# EAGLE design 3.3V_StepDown (EAGLE 9.4.2)
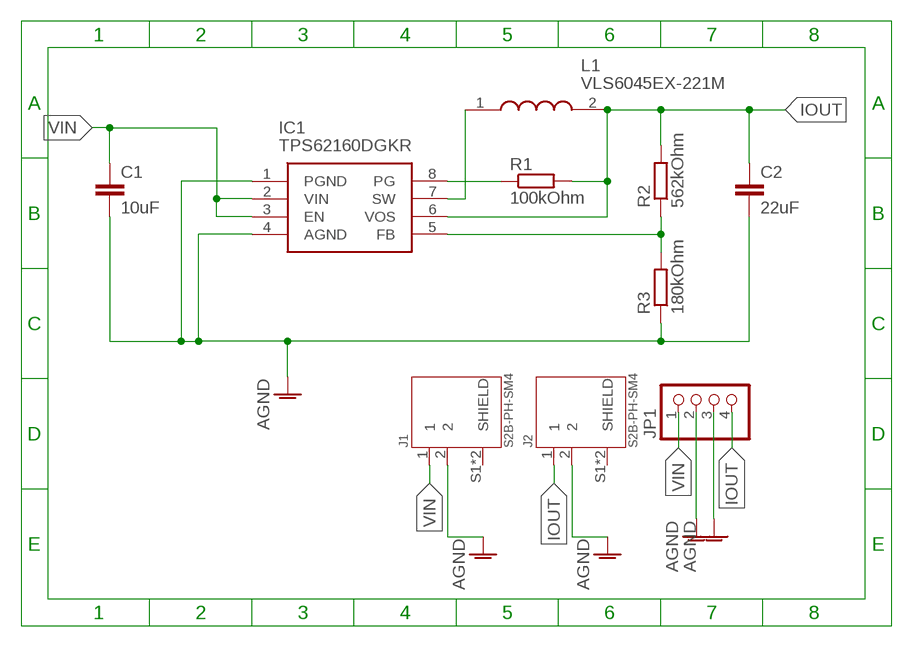
[diagram p0: schematic, sheet 1]

## Parts
C1  10uF  CNC5L1X7R1C106K160AEC1206  [C1206]
C2  22uF  GRM219R61C226ME15KC0805K  [C0805K]
IC1  TPS62160DGKR  [SOP65P490X110-8N]
J1  S2B-PH-SM4  [JST_S2B-PH-SM4-TB(LF)(SN)]
J2  S2B-PH-SM4  [JST_S2B-PH-SM4-TB(LF)(SN)]
JP1  PINHD-1X4  [1X04]
L1  VLS6045EX-221M  [INDPM6060X450N]
R1  100kOhm  RCS1206100KJNEAR1206  [R1206]
R2  562kOhm  ERJ-PB6B5623VR0805  [R0805]
R3  180kOhm  RN73R1ETTP1803D25R0402  [R0402]

## Nets
AGND: C1.2 C2.2 IC1.1(PGND) IC1.4(AGND) J1.2 J2.2 JP1.2 JP1.3 R3.1
FB2: IC1.5(FB) R2.1 R3.2
IOUT: C2.1 IC1.6(VOS) J2.1 JP1.4 L1.2 R1.2 R2.2
PG2: IC1.8(PG) R1.1
SW2: IC1.7(SW) L1.1
VIN: C1.1 IC1.2(VIN) IC1.3(EN) J1.1 JP1.1
Unconnected: J1.S1(SHIELD) J1.S2(SHIELD) J2.S1(SHIELD) J2.S2(SHIELD)

## Library data of the parts
C1 = MouserUseful:CNC5L1X7R1C106K160AE: CAPACITOR, European symbol; MAX: 16V; SPICEPREFIX: C
C2 = MouserUseful:GRM219R61C226ME15K: CAPACITOR, European symbol; MAXV: 16V; SPICEPREFIX: C
IC1 = MouserUseful:TPS62160DGKR: Switching Voltage Regulators 3V-17V 1A Step-Down Converter Source: Datasheet <http://www.ti.com/lit/ds/symlink/tps62160.pdf>; DESCRIPTION: Switching Voltage Regulators 3V-17V 1A Step-Down Converter; HEIGHT: 1.1mm; MANUFACTURER_NAME: Texas Instruments; MANUFACTURER_PART_NUMBER: TPS62160DGKR; MOUSER_PART_NUMBER: 595-TPS62160DGKR; MOUSER_PRICE-STOCK: https://www.mouser.com/Search/Refine.aspx?Keyword=595-TPS62160DGKR
J1 J2 = CommonParts:S2B-PH-SM4: PH Series 2 Position 2 mm Pitch Surface Mount Side Entry Shrouded Header; DESCRIPTION: PH Series 2 Position 2 mm Pitch Surface Mount Side Entry Shrouded Header; DIGI-KEY_PART_NUMBER: 455-1749-1-ND; DIGI-KEY_PURCHASE_URL: https://www.digikey.com/product-detail/en/jst-sales-america-inc/S2B-PH-SM4-TB_LF__SN_/455-1749-1-ND/926846?utm_source=snapeda&utm_medium=aggregator&utm_campaign=symbol; MF: JST Sales; MP: S2B-PH-SM4-TB_LF__SN_; PACKAGE: None
JP1 = pinhead:PINHD-1X4: PIN HEADER
L1 = MouserUseful:VLS6045EX-221M: Wirewound Inductor 220uH 500mA 1.15 mOhm TDK VLS-EX Series Shielded Wire-wound SMD Inductor with a Ferrite Core, 220 uH Wire-Wound 500mA Idc Source: Datasheet <https://product.tdk.com/info/en/catalog/datasheets/inductor_commercial_power_vls6045ex_en.pdf>; DESCRIPTION: Wirewound Inductor 220uH 500mA 1.15 mOhm TDK VLS-EX Series Shielded Wire-wound SMD Inductor with a Ferrite Core, 220 uH Wire-Wound 500mA Idc; HEIGHT: 4.5mm; MANUFACTURER_NAME: TDK; MANUFACTURER_PART_NUMBER: VLS6045EX-221M; MOUSER_PART_NUMBER: 810-VLS6045EX-221M; MOUSER_PRICE-STOCK: https://www.mouser.com/Search/Refine.aspx?Keyword=810-VLS6045EX-221M; RS_PART_NUMBER: 1247062; RS_PRICE-STOCK: http://uk.rs-online.com/web/p/products/1247062
R1 = MouserUseful:RCS1206100KJNEA: RESISTOR, European symbol; SPICEPREFIX: R; WATT: 0.5
R2 = MouserUseful:ERJ-PB6B5623V: RESISTOR, European symbol
R3 = MouserUseful:RN73R1ETTP1803D25: RESISTOR, European symbol; WATT: 0.5

## Board
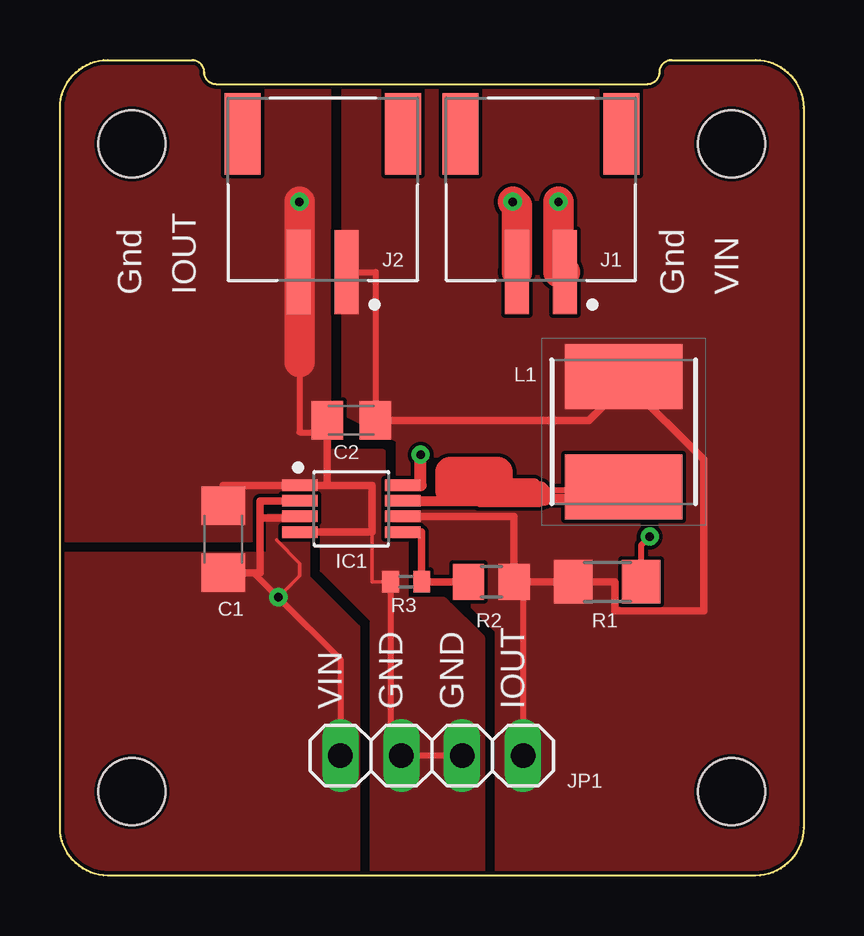
[diagram p1: board, top side]
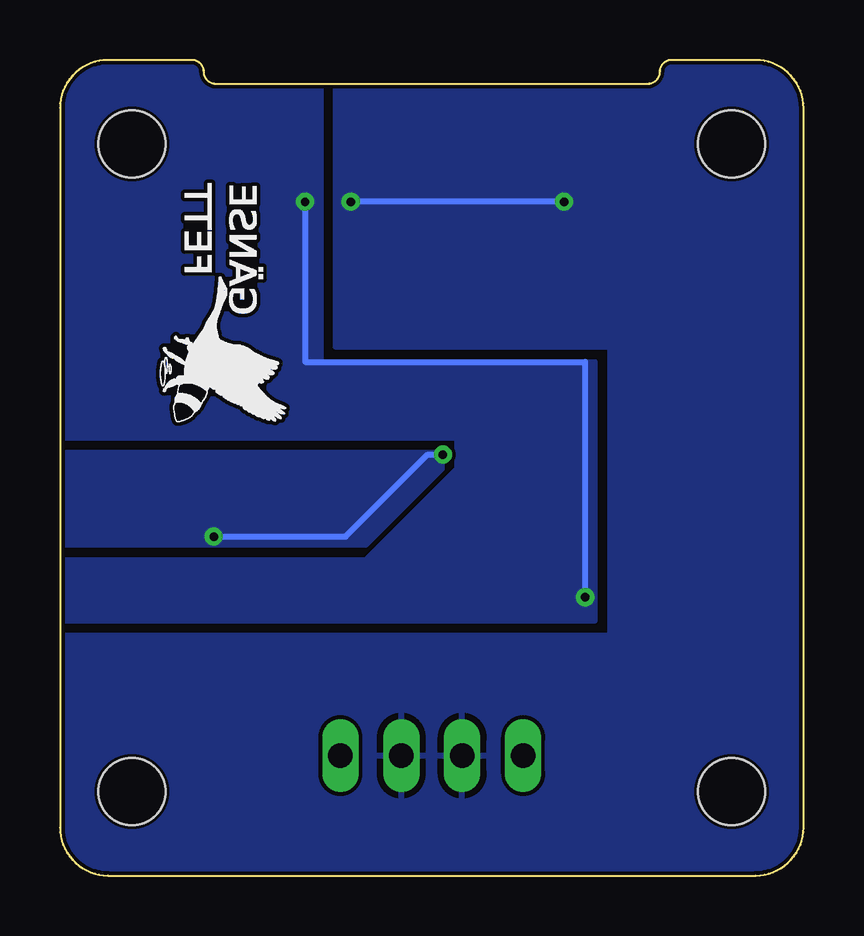
[diagram p2: board, bottom side, seen from below]

Size 31 x 34 mm. Coordinates in mm from the lower left corner, seen from the top.
Outline: 25.5,34 29,34 arc-90 31,32 31,2 arc-90 29,0 2,0 arc-90 0,2 0,32 arc-90 2,34 5.5,34 arc-90 6,33.5 arc90 6.5,33 24.5,33 arc90 25,33.5 arc-90 25.5,34
Copper layers (1*16): Top 0.035mm / dielectric 1.5mm / Bottom 0.035mm
Design rules "default *": minimum track width 6mil, minimum drill 0.35mm, track to track 6mil, track to pad 6mil, pad to pad 6mil, via to via 6mil, smd to smd 6mil, copper to edge 6mil, drill to drill 6mil, minimum pad ring 10mil, minimum via ring 8mil, stop-mask expansion 4mil, vias tented up to drill 0mil, thermal gap 10mil
Holes 2.8 mm at 3,3.5 28,3.5 3,30.5 28,30.5
bKeepout: area 26,18.9 to 26.1,18.9; area 22,18.9 to 22,18.9; area 25.9,18.9 to 26.2,18.9; area 22,18.9 to 22.1,19; area 25.9,18.9 to 26.1,19; area 26.1,18.9 to 26.2,19; area 22,19 to 22.1,19; area 25.8,19 to 26,19; area 26.1,19 to 26.2,19; area 22,19 to 22.1,19; area 22.2,19 to 22.3,19; area 25.8,19 to 25.9,19; 2280 more areas

### Footprints (pad centres in the part's own frame; a part is rotated, then mirrored left to right if it is on the bottom)
C1206 = smd 1.6 x 1.8: 1 -1.4,0; 2 1.4,0
C0805K = smd 1.3 x 1.6: 1 -1,0; 2 1,0
SOP65P490X110-8N = smd 1.471 x 0.481: 1 -2.15,0.975; 2 -2.15,0.325; 3 -2.15,-0.325; 4 -2.15,-0.975; 5 2.15,-0.975; 6 2.15,-0.325; 7 2.15,0.325; 8 2.15,0.975
JST_S2B-PH-SM4-TB(LF)(SN) = smd 1 x 3.5: 1 -1,0; 2 1,0 | smd 1.5 x 3.4: S1 -3.35,-5.75; S2 3.35,-5.75
1X04 = drill 1.016 long: 1 -3.81,0; 2 -1.27,0; 3 1.27,0; 4 3.81,0
INDPM6060X450N = smd 2.7 x 4.9: 1 -2.3,0; 2 2.3,0
R1206 = smd 1.6 x 1.803: 1 -1.422,0; 2 1.422,0
R0805 = smd 1.3 x 1.5: 1 -0.95,0; 2 0.95,0
R0402 = smd 0.7 x 0.9: 1 -0.65,0; 2 0.65,0

### Placement (x,y rotation side)
C1  6.81,14.03 90 top
C2  12.14,18.98 180 top
IC1  12.14,15.29 0 top
J1  20.05,25.16 180 top
J2  10.96,25.16 180 top
JP1  15.5,5 0 top
L1  23.5,18.5 90 top
R1  22.81,12.25 180 top
R2  17.99,12.25 0 top
R3  14.43,12.25 0 top

### Tracks (layer width: path | path; a pad name or v marks a point on that pad's centre or on a via)
AGND  (via drill 0.35)
  Top 0.152: R3.1 13.02,12.25 13.02,14.79
  Top 0.254: R3.1 13.77,5.51 JP1.2 JP1.3 | J2.2 9.98,25.16 9.98,21.41 9.98,18.47 11.14,18.47 C2.2
  Top 0.305: 11.14,16.27 IC1.1 6.81,16.27 C1.2 | 11.14,16.27 C2.2 | R3.1 | 11.14,16.27 13.02,16.27 13.02,14.79 13.02,14.32 IC1.4
  Top 1.27: v18.88,28.09 19.05,27.92 J1.2 | v9.98,28.09 9.98,21.41
  Bottom 0.254: v9.98,28.09 v18.88,28.09
  pour Top (no thermals): 0,14.03 8.08,14.03 8.08,15.93 10.94,15.93 10.94,12.76 13.03,10.67 13.03,0 17.61,0 17.61,9.9 16.02,11.48 14.43,11.48 14.43,13.82 13.48,13.82 13.48,17.65 11.21,17.65 11.21,34.49 0,34.49
  pour Bottom: 19.51,33.84 19.51,22.05 8.08,22.05 8.08,9.98 30.77,9.98 30.77,2 arc-90 28.77,0 2,0 arc-90 0,2 0,33.84
FB2
  Top 0.305: R2.1 R3.2 15.08,14.32 IC1.5
IOUT
  Top 0.254: R2.2 19.31,11.87 JP1.4 | J2.1 13.16,25.16 13.16,18.98 | 23,19.93 23,20 23,20.5 23.5,20.5 23.67,20.5
  Top 0.305: IC1.6 18.94,14.97 R2.2 R1.2 23.13,12.25 23.13,11.04 26.84,11.04 26.84,17.33 23.67,20.5 | C2.1 13.16,18.98 22.05,18.98 23,19.93
  Top 0.762: L1.2 23.5,20.5 23,20
  pour Top (no thermals): 11.84,34.35 11.84,19.29 14.11,18.15 14.11,14.34 15.06,14.34 15.06,12.12 16.34,12.12 18.24,10.21 18.24,0 29.08,0 arc90 31.08,2 31.08,34.35
PG2  (via drill 0.35)
  Top 0.254: IC1.8 15.03,16.27 15.04,16.28 | R1.1 24.23,13.78 v24.59,14.13
  Top 0.305: 14.68,16.27 IC1.8
  Top 0.508: 15.04,16.28 v15.04,17.55
  Bottom 0.254: v24.59,14.13 19.09,14.13 15.67,17.55 v15.04,17.55
  pour Bottom: 15.06,17.61 30.77,17.61 30.77,13.79 18.24,13.79 15.06,16.97
SW2
  Top 0.254: 14.22,15.55 16.72,15.55 | 17.48,15.62 17.48,16.06 18.24,16.06 20,16.06 23,16.06 | IC1.7 14.22,15.55 | 14.22,15.55 14.18,15.55 | 20,15.62 20.18,15.8 22.05,15.8 21.87,15.62 20,15.62
  Top 0.406: IC1.7 17.48,15.62
  Top 0.508: 17.48,15.62 20,15.62 | 18.49,16.06 19.76,16.06 19.76,16.31 18.24,16.31
  Top 0.762: L1.1 23.36,16.06 23,16.06 | 20,16.06 20.18,15.87 20.18,15.8
  Top 1.27: 16.27,16.06 16.27,16.82 18.24,16.82 18.24,16.31 18.24,16.06 16.46,16.06
VIN  (via drill 0.35)
  Top 0.152: v9.1,11.6 9.99,12.49 9.99,13.02 9.03,13.98 | IC1.2 9.03,15.62
  Top 0.254: 8.08,12.62 v9.1,11.6 11.69,9.02 JP1.1
  Top 0.305: IC1.3 10.05,14.91 8.33,14.91 | C1.1 8.08,12.62 8.33,12.62 8.33,14.91 | IC1.2 8.33,15.62 8.33,14.91
  Top 1.27: J1.1 20.78,25.16 v20.78,28.09
  Bottom 0.254: v9.1,11.6 9.1,21.41 20.78,21.41 v20.78,28.09
  pour Top (no thermals): 0,13.39 8.71,13.39 8.71,14.98 10.3,14.98 10.3,12.44 12.39,10.35 12.39,0 2,0 arc-90 0,2
  pour Bottom: 20.14,33.84 20.14,21.41 8.71,21.41 8.71,10.62 30.77,10.62 30.77,13.16 18.24,13.16 14.43,16.97 14.43,18.24 30.77,18.24 30.77,33.84
(copper drawn outside any net)
  shapes: Bottom area x2292

### Text on the board
tNames: Gnd | IOUT | Gnd | VIN | C1 | VIN | GND | GND | IOUT